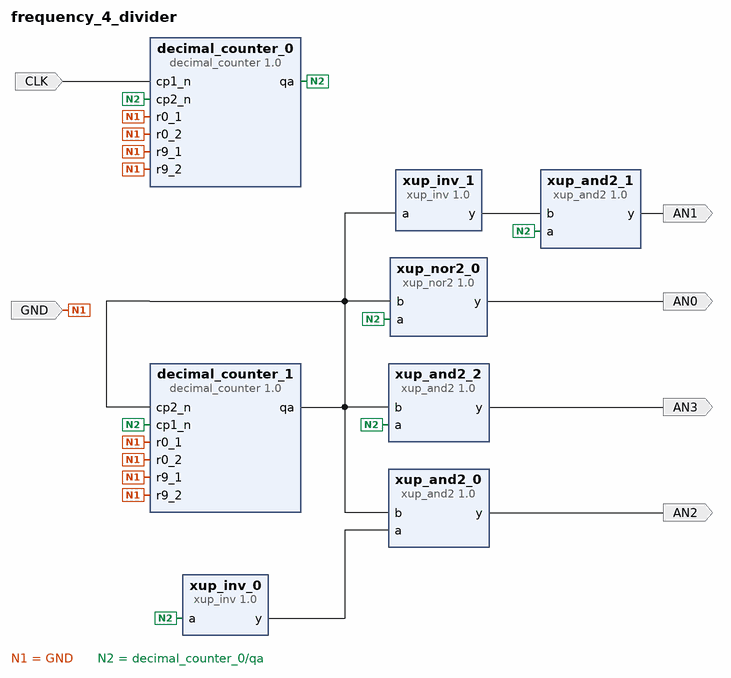
[diagram p0: block diagram of the top level]
# Vivado block design frequency_4_divider, xc7a35tcpg236-1, Vivado 2021.1
create_bd_design frequency_4_divider

create_bd_port -dir I CLK
create_bd_port -dir I GND
create_bd_port -dir O AN0
create_bd_port -dir O AN1
create_bd_port -dir O AN2
create_bd_port -dir O AN3

create_bd_cell -type ip -vlnv xilinx.com:XUP:decimal_counter:1.0 decimal_counter_0
set_property -dict {CONFIG.DELAY 0} [get_bd_cells decimal_counter_0]
create_bd_cell -type ip -vlnv xilinx.com:XUP:decimal_counter:1.0 decimal_counter_1
set_property -dict {CONFIG.DELAY 0} [get_bd_cells decimal_counter_1]
create_bd_cell -type ip -vlnv xilinx.com:xup:xup_nor2:1.0 xup_nor2_0
set_property -dict {CONFIG.DELAY 0} [get_bd_cells xup_nor2_0]
create_bd_cell -type ip -vlnv xilinx.com:xup:xup_and2:1.0 xup_and2_0
set_property -dict {CONFIG.DELAY 0} [get_bd_cells xup_and2_0]
create_bd_cell -type ip -vlnv xilinx.com:xup:xup_inv:1.0 xup_inv_0
set_property -dict {CONFIG.DELAY 0} [get_bd_cells xup_inv_0]
create_bd_cell -type ip -vlnv xilinx.com:xup:xup_inv:1.0 xup_inv_1
set_property -dict {CONFIG.DELAY 0} [get_bd_cells xup_inv_1]
create_bd_cell -type ip -vlnv xilinx.com:xup:xup_and2:1.0 xup_and2_1
set_property -dict {CONFIG.DELAY 0} [get_bd_cells xup_and2_1]
create_bd_cell -type ip -vlnv xilinx.com:xup:xup_and2:1.0 xup_and2_2
set_property -dict {CONFIG.DELAY 0} [get_bd_cells xup_and2_2]

# ---- connections ----

connect_bd_net [get_bd_ports CLK] [get_bd_pins decimal_counter_0/cp1_n]
connect_bd_net [get_bd_ports GND] \
  [get_bd_pins decimal_counter_0/r0_1] [get_bd_pins decimal_counter_0/r0_2] [get_bd_pins decimal_counter_0/r9_1] \
  [get_bd_pins decimal_counter_0/r9_2] [get_bd_pins decimal_counter_1/r0_1] [get_bd_pins decimal_counter_1/r0_2] \
  [get_bd_pins decimal_counter_1/r9_1] [get_bd_pins decimal_counter_1/r9_2]
connect_bd_net [get_bd_pins decimal_counter_0/qa] \
  [get_bd_pins decimal_counter_0/cp2_n] [get_bd_pins decimal_counter_1/cp1_n] [get_bd_pins xup_nor2_0/a] \
  [get_bd_pins xup_inv_0/a] [get_bd_pins xup_and2_1/a] [get_bd_pins xup_and2_2/a]
connect_bd_net [get_bd_pins decimal_counter_1/qa] \
  [get_bd_pins decimal_counter_1/cp2_n] [get_bd_pins xup_nor2_0/b] [get_bd_pins xup_and2_0/b] [get_bd_pins xup_inv_1/a] \
  [get_bd_pins xup_and2_2/b]
connect_bd_net [get_bd_pins xup_and2_0/y] [get_bd_ports AN2]
connect_bd_net [get_bd_pins xup_and2_1/y] [get_bd_ports AN1]
connect_bd_net [get_bd_pins xup_and2_2/y] [get_bd_ports AN3]
connect_bd_net [get_bd_pins xup_inv_0/y] [get_bd_pins xup_and2_0/a]
connect_bd_net [get_bd_pins xup_inv_1/y] [get_bd_pins xup_and2_1/b]
connect_bd_net [get_bd_pins xup_nor2_0/y] [get_bd_ports AN0]

validate_bd_design
save_bd_design
